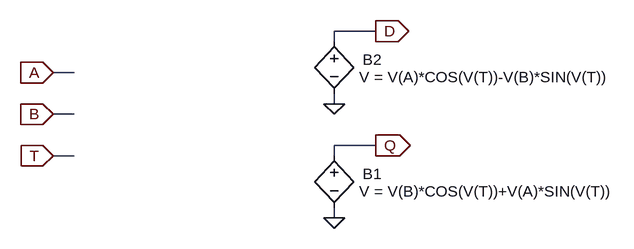
[diagram p0: schematic park.asc]
park.asc, the LTspice schematic file:
Version 4
SHEET 1 892 680
WIRE 272 -16 208 -16
WIRE 208 0 208 -16
WIRE -192 48 -224 48
WIRE 208 96 208 80
WIRE -192 112 -224 112
WIRE 272 160 208 160
WIRE -192 176 -224 176
WIRE 208 176 208 160
WIRE 208 272 208 256
FLAG -224 48 A
IOPIN -224 48 In
FLAG -224 112 B
IOPIN -224 112 In
FLAG 208 272 0
FLAG 272 160 Q
IOPIN 272 160 Out
FLAG 208 96 0
FLAG 272 -16 D
IOPIN 272 -16 Out
FLAG -224 176 T
IOPIN -224 176 In
SYMBOL bv 208 160 R0
WINDOW 0 44 44 Left 2
WINDOW 3 39 71 Left 2
SYMATTR InstName B1
SYMATTR Value V = V(B)*COS(V(T))+V(A)*SIN(V(T))
SYMBOL bv 208 -16 R0
WINDOW 0 44 44 Left 2
WINDOW 3 39 71 Left 2
SYMATTR InstName B2
SYMATTR Value V = V(A)*COS(V(T))-V(B)*SIN(V(T))

The netlist it stands for:
* park.asc
B1 Q 0 V = V(B)*COS(V(T))+V(A)*SIN(V(T))
B2 D 0 V = V(A)*COS(V(T))-V(B)*SIN(V(T))
.backanno
.end